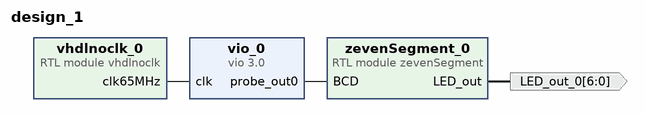
[diagram p0: block diagram of the top level]
# Vivado block design design_1, xc7z020clg484-1, Vivado 2021.1
create_bd_design design_1

create_bd_port -dir O -from 6 -to 0 LED_out_0

create_bd_cell -type module -reference vhdlnoclk vhdlnoclk_0
create_bd_cell -type ip -vlnv xilinx.com:ip:vio:3.0 vio_0
set_property -dict [list \
  CONFIG.C_NUM_PROBE_IN 0 \
  CONFIG.C_NUM_PROBE_OUT 1 \
  CONFIG.C_PROBE_IN0_WIDTH 4 \
  CONFIG.C_PROBE_OUT0_WIDTH 4 \
] [get_bd_cells vio_0]
create_bd_cell -type module -reference zevenSegment zevenSegment_0

# ---- connections ----

connect_bd_net [get_bd_pins vhdlnoclk_0/clk65MHz] [get_bd_pins vio_0/clk]
connect_bd_net [get_bd_pins vio_0/probe_out0] [get_bd_pins zevenSegment_0/BCD]
connect_bd_net [get_bd_pins zevenSegment_0/LED_out] [get_bd_ports LED_out_0]

validate_bd_design
save_bd_design
